# EAGLE design EEGAmp_SMT (EAGLE 9.6.2)
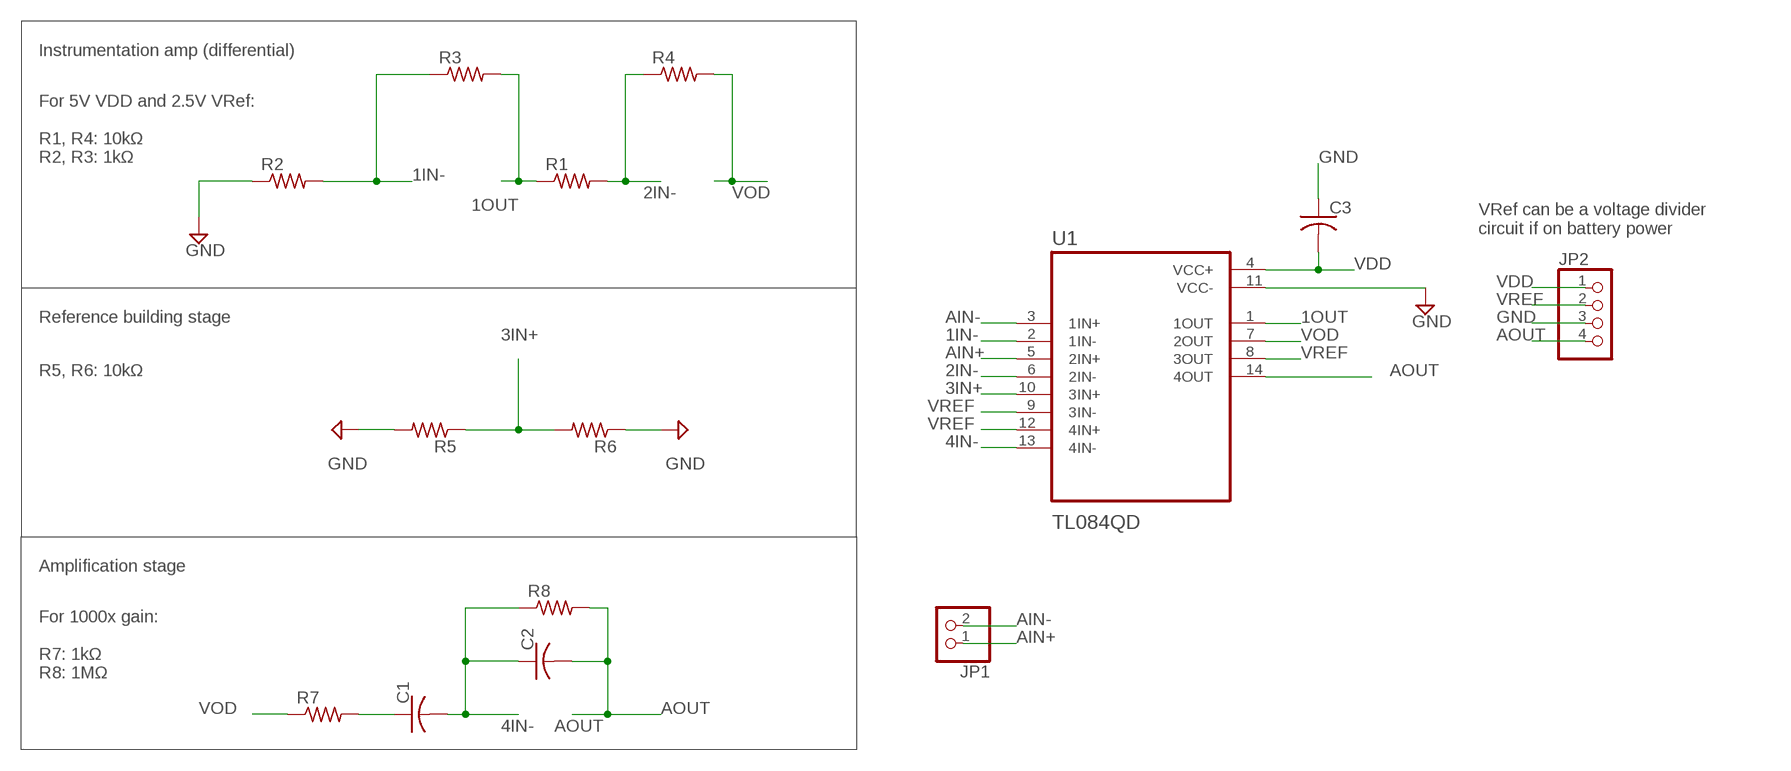
[diagram p0: schematic, sheet 1]

## Parts
C1  C-USC0402  [C0402]
C2  C-USC0402  [C0402]
C3  C-USC0402  [C0402]
JP1  PINHD-1X2  [1X02]
JP2  PINHD-1X4  [1X04]
R1  R-US_R0402  [R0402]
R2  R-US_R0402  [R0402]
R3  R-US_R0402  [R0402]
R4  R-US_R0402  [R0402]
R5  R-US_R0402  [R0402]
R6  R-US_R0402  [R0402]
R7  R-US_R0402  [R0402]
R8  R-US_R0402  [R0402]
U1  TL084QD  [SOIC127P600X175-14N]

## Nets
1IN-: R2.2 R3.1 U1.2(1IN-)
1OUT: R1.1 R3.2 U1.1(1OUT)
2IN-: R1.2 R4.1 U1.6(2IN-)
3IN+: R5.1 R6.2 U1.10(3IN+)
4IN-: C1.2 C2.1 R8.1 U1.13(4IN-)
AIN+: JP1.1 U1.5(2IN+)
AIN-: JP1.2 U1.3(1IN+)
AOUT: C2.2 JP2.4 R8.2 U1.14(4OUT)
GND: C3.1 JP2.3 R2.1 R5.2 R6.1 U1.11(VCC-)
N$9: C1.1 R7.2
VDD: C3.2 JP2.1 U1.4(VCC+)
VOD: R4.2 R7.1 U1.7(2OUT)
VREF: JP2.2 U1.8(3OUT) U1.9(3IN-) U1.12(4IN+)

## Notes on the sheet
- Instrumentation amp (differential)
- For 5V VDD and 2.5V VRef:
  
  R1, R4: 10kΩ
  R2, R3: 1kΩ
- VRef can be a voltage divider 
  circuit if on battery power
- Reference building stage
- R5, R6: 10kΩ
- Amplification stage
- For 1000x gain:
  
  R7: 1kΩ
  R8: 1MΩ

## Library data of the parts
C1-C3 = rcl:C-US: CAPACITOR, American symbol; SPICEPREFIX: C
JP1 = pinhead:PINHD-1X2: PIN HEADER
JP2 = pinhead:PINHD-1X4: PIN HEADER
R1-R8 = rcl:R-US_: RESISTOR, American symbol; SPICEPREFIX: R
U1 = TL084QD:TL084QD: Check availability <https://pricing.snapeda.com/parts/TL084QD/Texas%20Instruments/view-part?ref=eda>; AVAILABILITY: In Stock; CHECK_PRICES: https://www.snapeda.com/parts/TL084QD/Texas+Instruments/view-part/?ref=eda; DESCRIPTION: Quad, 30-V, 3-MHz, 13-V/µs slew rate, In to V+, JFET-input op amp; MF: Texas Instruments; MP: TL084QD; PACKAGE: SOIC-14 Texas Instruments; PRICE: None; PURCHASE-URL: https://www.snapeda.com/api/url_track_click_mouser/?unipart_id=1136083&manufacturer=Texas Instruments&part_name=TL084QD&search_term=tl084; SNAPEDA_LINK: https://www.snapeda.com/parts/TL084QD/Texas+Instruments/view-part/?ref=snap

## Board
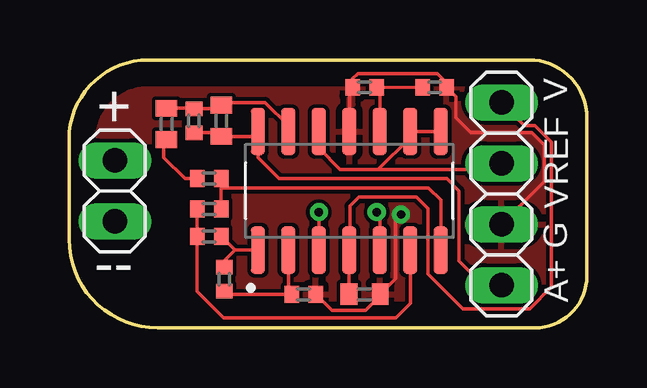
[diagram p1: board, top side]
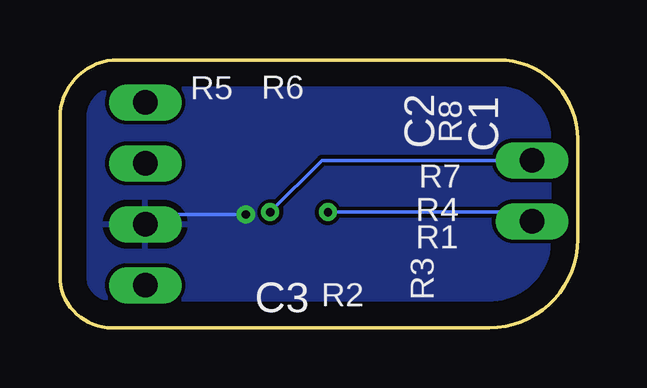
[diagram p2: board, bottom side, seen from below]

Size 21.59 x 11.18 mm. Coordinates in mm from the lower left corner, seen from the top.
Outline: 0,7.87 arc-90 3.3,11.18 19.18,11.18 arc-90 21.59,8.76 21.59,2.16 arc-90 19.43,0 3.68,0 arc-90 0,3.68 0,7.87
Copper layers (1*16): Top 0.035mm / dielectric 1.5mm / Bottom 0.035mm
Design rules "default": minimum track width 6mil, minimum drill 0.35mm, track to track 6mil, track to pad 6mil, pad to pad 6mil, via to via 6mil, smd to smd 6mil, copper to edge 40mil, drill to drill 6mil, minimum pad ring 10mil, minimum via ring 8mil, stop-mask expansion 4mil, vias tented up to drill 0mil, thermal gap 10mil

### Footprints (pad centres in the part's own frame; a part is rotated, then mirrored left to right if it is on the bottom)
C0402 = smd 0.7 x 0.9: 1 -0.65,0; 2 0.65,0
1X02 = drill 1.016 long: 1 -1.27,0; 2 1.27,0
1X04 = drill 1.016 long: 1 -3.81,0; 2 -1.27,0; 3 1.27,0; 4 3.81,0
R0402 = smd 0.6 x 0.7: 1 -0.5,0; 2 0.5,0
SOIC127P600X175-14N = smd 1.97 x 0.6: 1 -2.475,3.81; 2 -2.475,2.54; 3 -2.475,1.27; 4 -2.475,0; 5 -2.475,-1.27; 6 -2.475,-2.54; 7 -2.475,-3.81; 8 2.475,-3.81; 9 2.475,-2.54; 10 2.475,-1.27; 11 2.475,0; 12 2.475,1.27; 13 2.475,2.54; 14 2.475,3.81

### Placement (x,y rotation side)
C1  4.06,8.51 90 top
C2  6.35,8.64 270 top
C3  12.32,1.4 180 top
JP1  1.9,5.71 270 top
JP2  18.03,5.59 270 top
R1  5.84,3.81 180 top
R2  9.78,1.4 180 top
R3  6.48,2.03 90 top
R4  5.84,4.95 0 top
R5  15.24,10.03 0 top
R6  12.32,10.03 0 top
R7  5.84,6.22 180 top
R8  5.21,8.64 270 top
U1  11.68,5.71 90 top

### Tracks (layer width: path | path; a pad name or v marks a point on that pad's centre or on a via)
1IN-
  Top 0.152: U1.2 9.14,1.53 R2.2 6.61,1.4 R3.1
1OUT
  Top 0.152: 6.48,2.73 R3.2 6.48,2.8 6.91,3.24 | R1.1 6.91,3.24 | 6.91,3.24 U1.1
2IN-
  Top 0.152: U1.6 14.22,1.02 13.62,0.41 6.44,0.41 5.34,1.52 R1.2 R4.1
3IN+
  Top 0.152: R5.1 R6.2 12.95,9.9 U1.10
4IN-
  Top 0.152: U1.13 9.14,8.44 8.18,9.4 6.47,9.4 C2.1 6.2,9.14 R8.1 5.18,9.16 C1.2
AIN+  (via drill 0.35)
  Top 0.152: v12.83,4.83 12.95,4.7 U1.5
  Bottom 0.152: JP1.1 10.67,6.99 v12.83,4.83
AIN-  (via drill 0.35)
  Top 0.152: v10.41,4.83 U1.3
  Bottom 0.152: v10.41,4.83 2.29,4.83 JP1.2
AOUT
  Top 0.152: R8.2 6.2,8.14 C2.2 7.67,7.99 U1.14 7.87,7.11 8.76,6.22 15.75,6.22 16.26,5.71 16.26,2.79 17.27,1.78 JP2.4
GND  (via drill 0.35)
  Top 0.152: R2.1 10.97,0.72 12.37,0.72 12.97,1.32 C3.1 13.6,2.03 13.6,4.49 v13.84,4.73 | JP2.3 19.81,6.1 19.81,7.62 19.3,8.14 16.75,8.14 16.12,8.76 16.12,9.65 R5.2 15.74,10.23 15.36,10.61 12.04,10.61 11.82,10.39 R6.1 11.69,9.91 U1.11
  Bottom 0.152: v13.84,4.73 17.62,4.73 JP2.3
  pour Bottom: 25.27,13.59 25.27,13.59 25.27,-2.41 -2.29,-2.41 -2.29,13.59
  pour Top: -2.54,13.21 25.02,13.21 25.02,-2.03 -2.54,-2.03
N$9
  Top 0.152: C1.1 3.95,7.74 3.95,7.11 4.83,6.22 R7.2
VDD
  Top 0.152: C3.2 11.67,3.23 U1.4 11.71,3.27 11.71,5.08 12.1,5.46 14.47,5.46 14.96,4.97 14.96,2.25 16.43,0.79 19.21,0.79 20.12,1.7 20.12,7.75 19.42,8.44 18.99,8.44 JP2.1
VOD
  Top 0.152: R7.1 R4.2 6.34,5.84 14.99,5.84 15.49,5.33 U1.7
VREF
  Top 0.152: U1.12 10.41,7.49 11.3,6.6 12.89,6.6 | 12.89,6.6 14.22,7.94 U1.9 U1.8 | 12.89,6.6 17.78,6.6 JP2.2

### Text on the board
tNames: V | + | VREF | G | -- | A+